# EAGLE design gt-jtx-m32-ver1.0 (EAGLE 8.1.0)
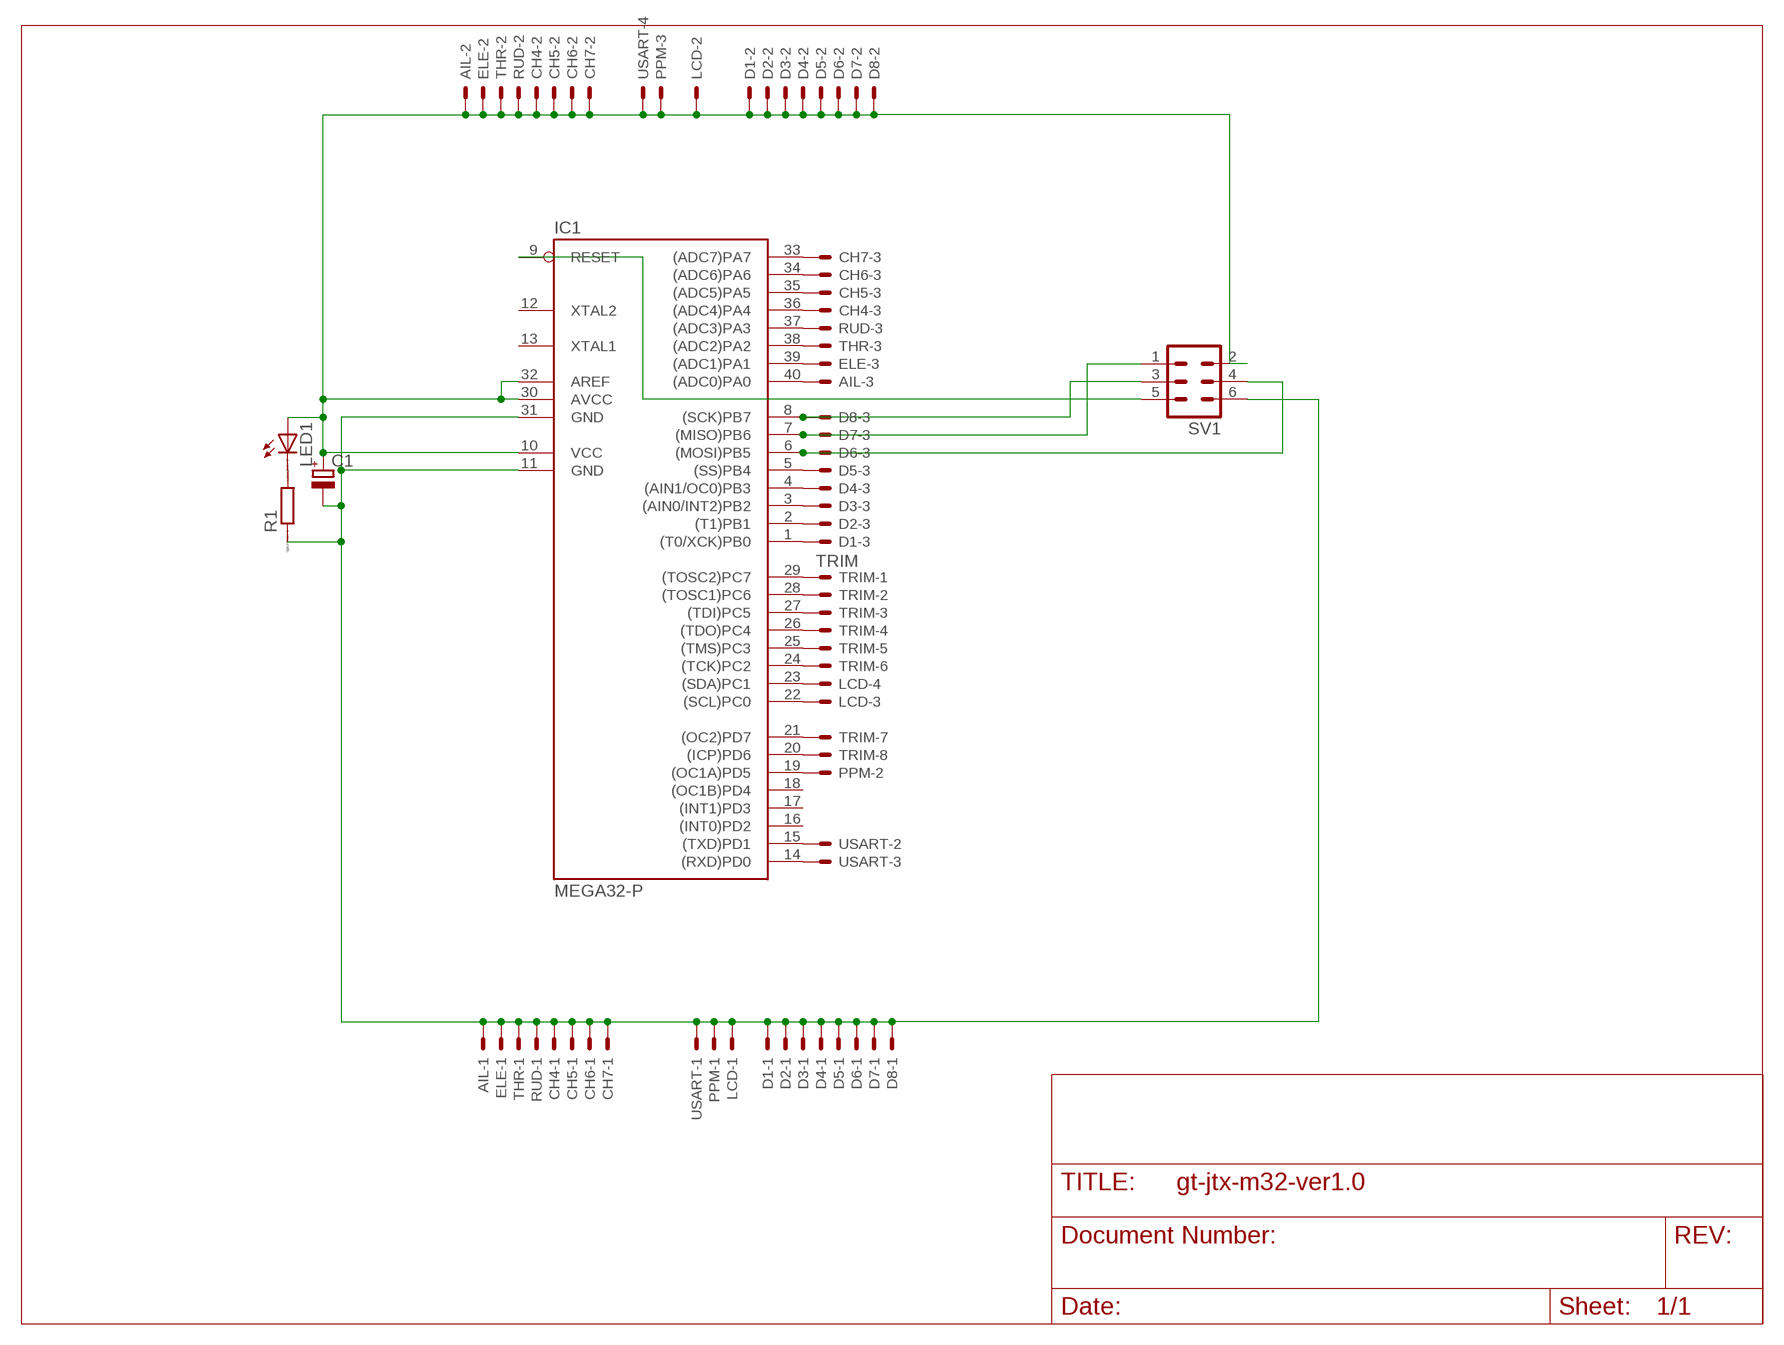
[diagram p0: schematic, sheet 1]

## Parts
AIL  JST-XH-03-PIN-LONG-PAD  [JST-XH-03-PACKAGE-LONG-PAD]
C1  CPOL-EUC  [PANASONIC_C]
CH4  JST-XH-03-PIN-LONG-PAD  [JST-XH-03-PACKAGE-LONG-PAD]
CH5  JST-XH-03-PIN-LONG-PAD  [JST-XH-03-PACKAGE-LONG-PAD]
CH6  JST-XH-03-PIN-LONG-PAD  [JST-XH-03-PACKAGE-LONG-PAD]
CH7  JST-XH-03-PIN-LONG-PAD  [JST-XH-03-PACKAGE-LONG-PAD]
D1  JST-XH-03-PIN-LONG-PAD  [JST-XH-03-PACKAGE-LONG-PAD]
D2  JST-XH-03-PIN-LONG-PAD  [JST-XH-03-PACKAGE-LONG-PAD]
D3  JST-XH-03-PIN-LONG-PAD  [JST-XH-03-PACKAGE-LONG-PAD]
D4  JST-XH-03-PIN-LONG-PAD  [JST-XH-03-PACKAGE-LONG-PAD]
D5  JST-XH-03-PIN-LONG-PAD  [JST-XH-03-PACKAGE-LONG-PAD]
D6  JST-XH-03-PIN-LONG-PAD  [JST-XH-03-PACKAGE-LONG-PAD]
D7  JST-XH-03-PIN-LONG-PAD  [JST-XH-03-PACKAGE-LONG-PAD]
D8  JST-XH-03-PIN-LONG-PAD  [JST-XH-03-PACKAGE-LONG-PAD]
ELE  JST-XH-03-PIN-LONG-PAD  [JST-XH-03-PACKAGE-LONG-PAD]
IC1  MEGA32-P  [DIL40]
LCD  JST-XH-04-PIN-LONG-PAD  [JST-XH-04-PACKAGE-LONG-PAD]
LED1  LED5MM  [LED5MM]
PPM  JST-XH-03-PIN-LONG-PAD  [JST-XH-03-PACKAGE-LONG-PAD]
R1  R0204/7  [0204/7]
RUD  JST-XH-03-PIN-LONG-PAD  [JST-XH-03-PACKAGE-LONG-PAD]
SV1  MA03-2  [MA03-2]
THR  JST-XH-03-PIN-LONG-PAD  [JST-XH-03-PACKAGE-LONG-PAD]
TRIM  TRIM  JST-XH-08-PIN-LONG-PAD  [JST-XH-08-PACKAGE-LONG-PAD]
USART  JST-XH-04-PIN-LONG-PAD  [JST-XH-04-PACKAGE-LONG-PAD]

## Nets
GND: AIL.1 C1.- CH4.1 CH5.1 CH6.1 CH7.1 D1.1 D2.1 D3.1 D4.1 D5.1 D6.1 D7.1 D8.1 ELE.1 IC1.11(GND) IC1.31(GND) LCD.1 PPM.1 R1.1 RUD.1 SV1.6 THR.1 USART.1
N$1: CH5.3 IC1.35((ADC5)PA5)
N$2: CH6.3 IC1.34((ADC6)PA6)
N$3: IC1.29((TOSC2)PC7) TRIM.1
N$4: IC1.28((TOSC1)PC6) TRIM.2
N$5: D1.3 IC1.1((T0/XCK)PB0)
N$6: IC1.15((TXD)PD1) USART.2
N$7: IC1.27((TDI)PC5) TRIM.3
N$8: IC1.26((TDO)PC4) TRIM.4
N$9: IC1.9(RESET) SV1.5
N$10: IC1.25((TMS)PC3) TRIM.5
N$11: IC1.24((TCK)PC2) TRIM.6
N$12: D6.3 IC1.6((MOSI)PB5) SV1.4
N$13: D7.3 IC1.7((MISO)PB6) SV1.1
N$14: D8.3 IC1.8((SCK)PB7) SV1.3
N$15: D2.3 IC1.2((T1)PB1)
N$16: IC1.21((OC2)PD7) TRIM.7
N$17: IC1.20((ICP)PD6) TRIM.8
N$18: IC1.14((RXD)PD0) USART.3
N$19: IC1.23((SDA)PC1) LCD.4
N$20: CH7.3 IC1.33((ADC7)PA7)
N$21: CH4.3 IC1.36((ADC4)PA4)
N$22: IC1.22((SCL)PC0) LCD.3
N$23: IC1.19((OC1A)PD5) PPM.2
N$24: D3.3 IC1.3((AIN0/INT2)PB2)
N$25: D4.3 IC1.4((AIN1/OC0)PB3)
N$26: D5.3 IC1.5((SS)PB4)
N$27: IC1.37((ADC3)PA3) RUD.3
N$28: IC1.38((ADC2)PA2) THR.3
N$29: ELE.3 IC1.39((ADC1)PA1)
N$30: AIL.3 IC1.40((ADC0)PA0)
N$32: LED1.K(C) R1.2
VCC: AIL.2 C1.+ CH4.2 CH5.2 CH6.2 CH7.2 D1.2 D2.2 D3.2 D4.2 D5.2 D6.2 D7.2 D8.2 ELE.2 IC1.10(VCC) IC1.30(AVCC) IC1.32(AREF) LCD.2 LED1.A PPM.3 RUD.2 SV1.2 THR.2 USART.4
Unconnected: IC1.12(XTAL2) IC1.13(XTAL1) IC1.16((INT0)PD2) IC1.17((INT1)PD3) IC1.18((OC1B)PD4)

## Library data of the parts
AIL CH4-CH7 D1-D8 ELE PPM RUD THR = Rembrandt Electronics - JST XH Connectors v1-0:JST-XH-03-PIN: JST XH Connector 2 Pin Wire to board connector. Pitch: 2,54 mm, (0.100") Number of pins: 3 Created by Rembrandt Electronics www.rembrandtelectronics.com
C1 = rcl:CPOL-EU: POLARIZED CAPACITOR, European symbol
IC1 = atmel:MEGA32-P: MICROCONTROLLER 32 Kbytes FLASH 2 Kbytes SRAM 1 Kbytes EEPROM USART 8-channel 10 bit ADC Source: www.atmel.com .. doc2503.pdf; MPN: ATMEGA32-16PU; OC_FARNELL: 1661729; OC_NEWARK: 51P1794
LCD USART = Rembrandt Electronics - JST XH Connectors v1-0:JST-XH-04-PIN: JST XH Connector 2 Pin Wire to board connector. Pitch: 2,54 mm, (0.100") Number of pins: 4 Created by Rembrandt Electronics www.rembrandtelectronics.com
LED1 = led:LED: LED OSRAM: - CHIPLED LG R971, LG N971, LY N971, LG Q971, LY Q971, LO R971, LY R971 LH N974, LH R974 LS Q976, LO Q976, LY Q976 LO Q996 - Hyper CHIPLED LW Q18S LB Q993, LB Q99A, LB R99A - SideLED LS A670, LO A670, LY A670, LG A670, LP A670 LB A673, LV A673, LT A673, LW A673 LH A674 LY A675 LS A676, LA A676, LO A676, LY A676, LW A676 LS A679, LY A679, LG A679 - Hyper Micro SIDELED® LS Y876, LA Y876, LO Y876, LY Y876 LT Y87S - SmartLED LW L88C, LW L88S LB L89C, LB L89S, LG L890 LS L89K, LO L89K, LY L89K LS L896, LA L896, LO L896, LY L896 - TOPLED LS T670, LO T670, LY T670, LG T670, LP T670 LSG T670, LSP T670, LSY T670, LOP T670, LYG T670 LG T671, LOG T671, LSG T671 LB T673, LV T673, LT T673, LW T673 LH T674 LS T676, LA T676, LO T676, LY T676, LB T676, LH T676, LSB T676, LW T676 LB T67C, LV T67C, LT T67C, LS T67K, LO T67K, LY T67K, LW E67C LS E67B, LA E67B, LO E67B, LY E67B, LB E67C, LV E67C, LT E67C LW T67C LS T679, LY T679, LG T679 LS T770, LO T770, LY T770, LG T770, LP T770 LB T773, LV T773, LT T773, LW T773 LH T774 LS E675, LA E675, LY E675, LS T675 LS T776, LA T776, LO T776, LY T776, LB T776 LHGB T686 LT T68C, LB T68C - Hyper Mini TOPLED® LB M676 - Mini TOPLED Santana® LG M470 LS M47K, LO M47K, LY M47K Source: http://www.osram.convergy.de LUXEON: - LUMILED® LXK2-PW12-R00, LXK2-PW12-S00, LXK2-PW14-U00, LXK2-PW14-V00 LXK2-PM12-R00, LXK2-PM12-S00, LXK2-PM14-U00 LXK2-PE12-Q00, LXK2-PE12-R00, LXK2-PE12-S00, LXK2-PE14-T00, LXK2-PE14-U00 LXK2-PB12-K00, LXK2-PB12-L00, LXK2-PB12-M00, LXK2-PB14-N00, LXK2-PB14-P00, LXK2-PB14-Q00 LXK2-PR12-L00, LXK2-PR12-M00, LXK2-PR14-Q00, LXK2-PR14-R00 LXK2-PD12-Q00, LXK2-PD12-R00, LXK2-PD12-S00 LXK2-PH12-R00, LXK2-PH12-S00 LXK2-PL12-P00, LXK2-PL12-Q00, LXK2-PL12-R00 Source: www.luxeon.com KINGBRIGHT: KA-3528ASYC Source: www.kingbright.com
R1 = eagle-ltspice:R: RESISTOR, European symbol; SPICEMODEL: NONE; SPICEPREFIX: R
SV1 = con-lstb:MA03-2: PIN HEADER; OC_FARNELL: unknown; OC_NEWARK: unknown
TRIM = Rembrandt Electronics - JST XH Connectors v1-0:JST-XH-08-PIN: JST XH Connector 2 Pin Wire to board connector. Pitch: 2,54 mm, (0.100") Number of pins: 8 Created by Rembrandt Electronics www.rembrandtelectronics.com

## Board
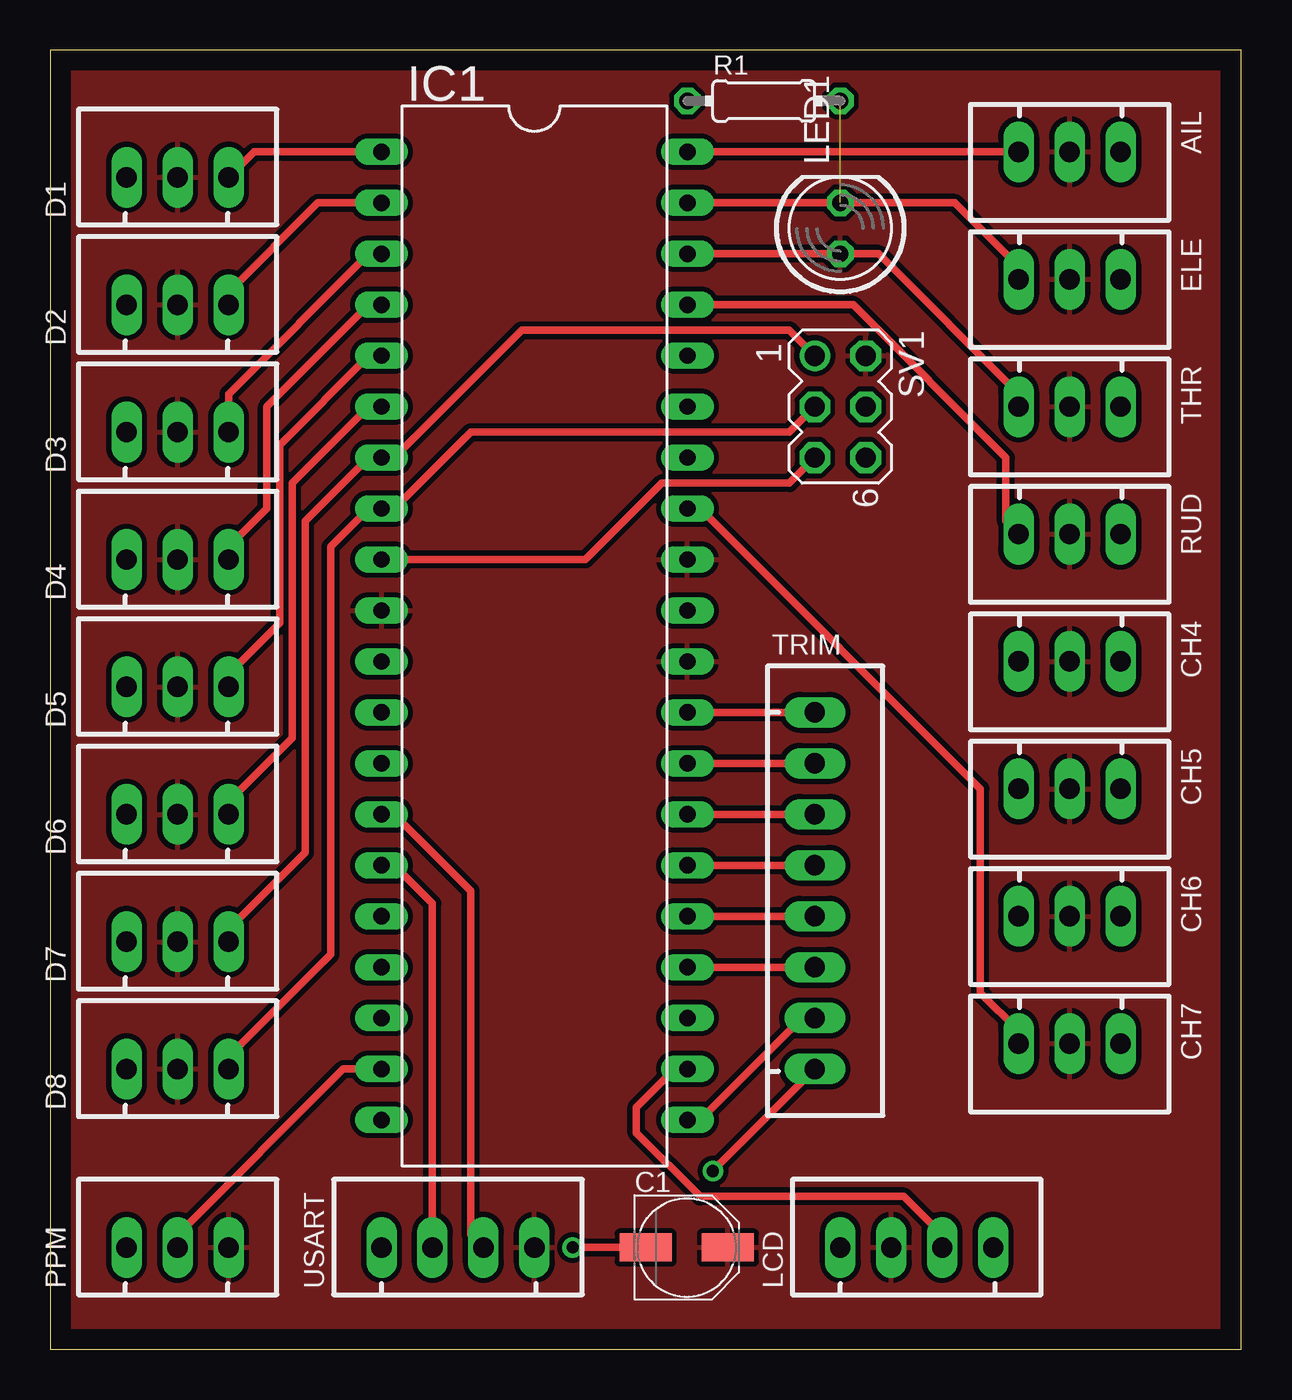
[diagram p1: board, top side]
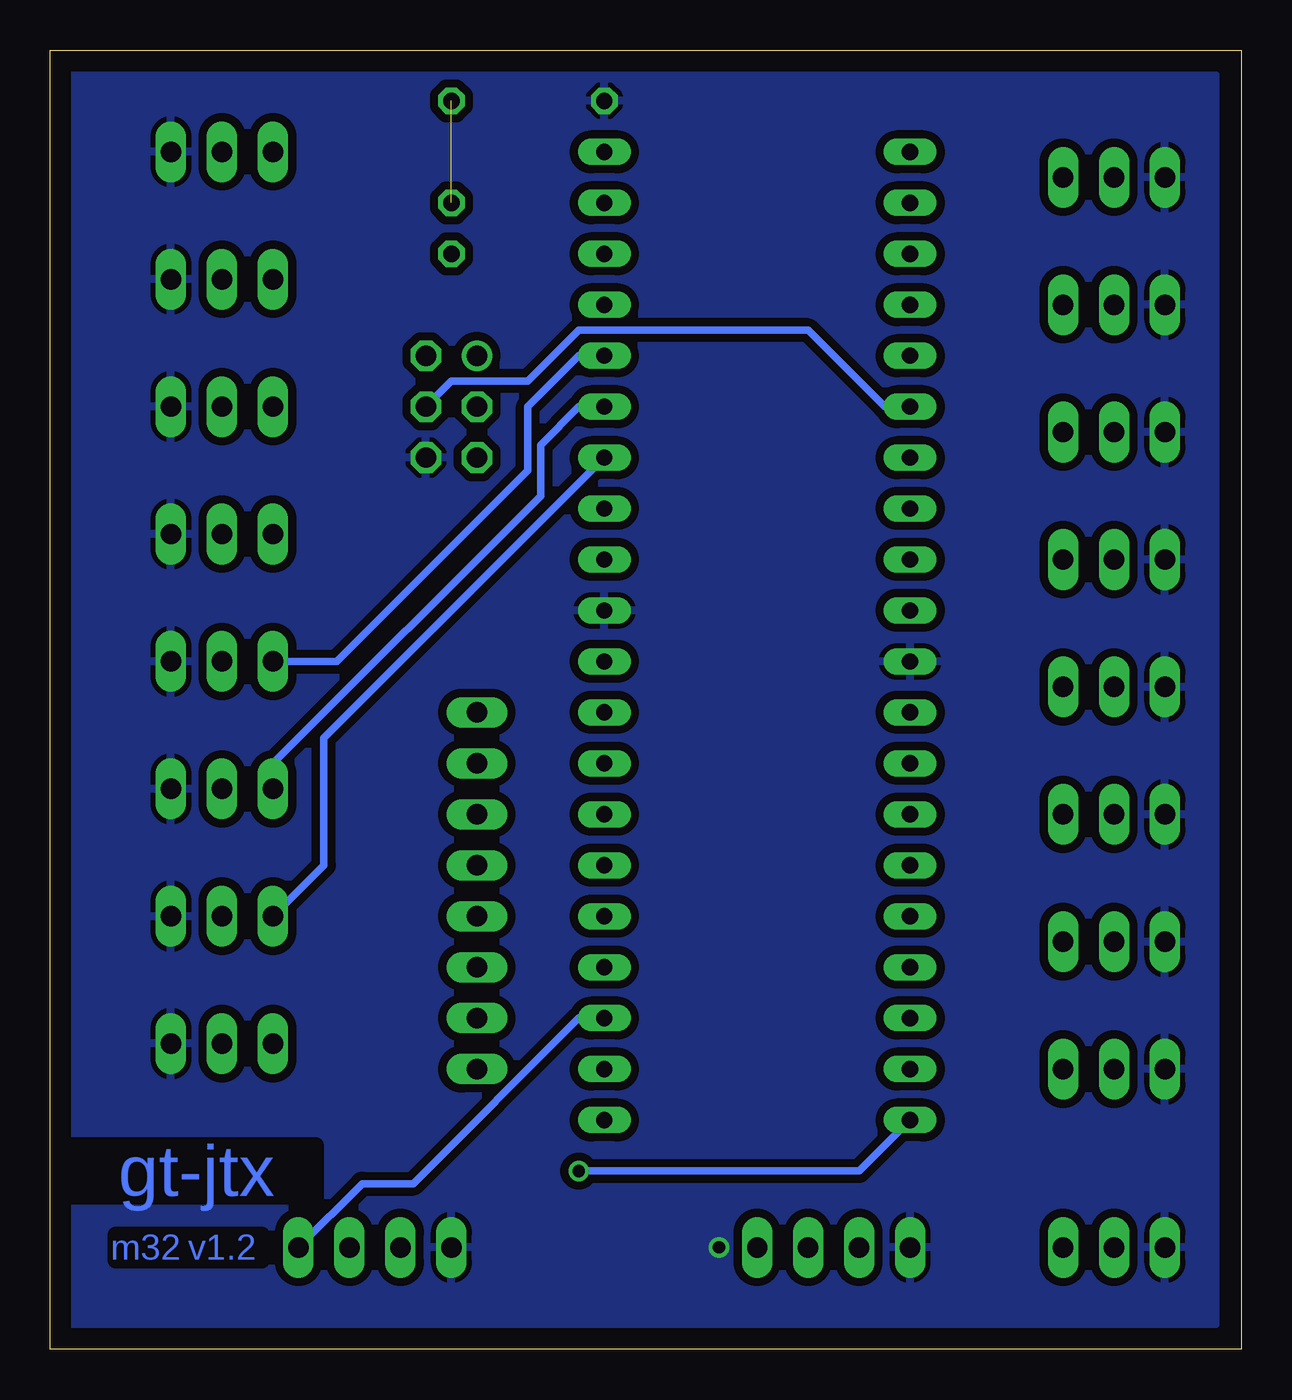
[diagram p2: board, bottom side, seen from below]

Size 59.36 x 64.76 mm. Coordinates in mm from the lower left corner, seen from the top.
Outline: 0,0 59.36,0 59.36,64.76 0,64.76 0,0
Copper layers (1*16): Top 0.035mm / dielectric 1.5mm / Bottom 0.035mm
Design rules "default *": minimum track width 15mil, minimum drill 24mil, track to track 10mil, track to pad 10mil, pad to pad 10mil, via to via 10mil, smd to smd 8mil, copper to edge 40mil, drill to drill 8mil, minimum pad ring 10mil, minimum via ring 8mil, stop-mask expansion 4mil, vias tented up to drill 0mil, thermal gap 10mil

### Footprints (pad centres in the part's own frame; a part is rotated, then mirrored left to right if it is on the bottom)
JST-XH-03-PACKAGE-LONG-PAD = drill 1.016 long: 1 -2.54,0; 2 0,0; 3 2.54,0
PANASONIC_C = smd 2.6 x 1.4: + 2.05,0; - -2.05,0
DIL40 = drill 0.813 long: 1 -24.13,-7.62; 2 -21.59,-7.62; 3 -19.05,-7.62; 4 -16.51,-7.62; 5 -13.97,-7.62; 6 -11.43,-7.62; 7 -8.89,-7.62; 8 -6.35,-7.62; 9 -3.81,-7.62; 10 -1.27,-7.62; 11 1.27,-7.62; 12 3.81,-7.62; 13 6.35,-7.62; 14 8.89,-7.62; 15 11.43,-7.62; 16 13.97,-7.62; 17 16.51,-7.62; 18 19.05,-7.62; 19 21.59,-7.62; 20 24.13,-7.62; 21 24.13,7.62; 22 21.59,7.62; 23 19.05,7.62; 24 16.51,7.62; 25 13.97,7.62; 26 11.43,7.62; 27 8.89,7.62; 28 6.35,7.62; 29 3.81,7.62; 30 1.27,7.62; 31 -1.27,7.62; 32 -3.81,7.62; 33 -6.35,7.62; 34 -8.89,7.62; 35 -11.43,7.62; 36 -13.97,7.62; 37 -16.51,7.62; 38 -19.05,7.62; 39 -21.59,7.62; 40 -24.13,7.62
JST-XH-04-PACKAGE-LONG-PAD = drill 1.016 long: 1 -3.81,0; 2 -1.27,0; 3 1.27,0; 4 3.81,0
LED5MM = drill 0.813 octagon: A -1.27,0; K 1.27,0
0204/7 = drill 0.813 octagon: 1 -3.81,0; 2 3.81,0
MA03-2 = drill 1.016: 1 -2.54,-1.27 | drill 1.016 octagon: 2 -2.54,1.27; 3 0,-1.27; 4 0,1.27; 5 2.54,-1.27; 6 2.54,1.27
JST-XH-08-PACKAGE-LONG-PAD = drill 1.016 long: 1 -8.89,0; 2 -6.35,0; 3 -3.81,0; 4 -1.27,0; 5 1.27,0; 6 3.81,0; 7 6.35,0; 8 8.89,0

### Placement (x,y rotation side)
AIL  50.8,59.69 180 top
C1  31.72,5.08 0 top
CH4  50.8,34.29 180 top
CH5  50.8,27.94 180 top
CH6  50.8,21.59 180 top
CH7  50.8,15.24 180 top
D1  6.35,58.42 0 top
D2  6.35,52.07 0 top
D3  6.35,45.72 0 top
D4  6.35,39.37 0 top
D5  6.35,33.02 0 top
D6  6.35,26.67 0 top
D7  6.35,20.32 0 top
D8  6.35,13.97 0 top
ELE  50.8,53.34 180 top
IC1  24.13,35.56 270 top
LCD  43.18,5.08 0 top
LED1  39.37,55.88 90 top
PPM  6.35,5.08 0 top
R1  35.56,62.23 0 top
RUD  50.8,40.64 180 top
SV1  39.37,46.99 270 top
THR  50.8,46.99 180 top
TRIM  38.1,22.86 270 top
USART  20.32,5.08 0 top

### Tracks (layer width: path | path; a pad name or v marks a point on that pad's centre or on a via)
GND  (via drill 0.61)
  Top 0.381: v26.04,5.08 C1.-
  pour Bottom (isolate 0.406): 1.27,63.5 58.42,63.5 58.42,1.27 1.27,1.27
N$1
  Bottom 0.381: IC1.35 33.02,46.99 34.92,45.09 34.92,42.55 48.26,29.21 CH5.3
N$2
  Bottom 0.381: IC1.34 45.72,30.48 45.72,24.13 CH6.3
N$3
  Top 0.381: TRIM.1 IC1.29
N$4
  Top 0.381: TRIM.2 IC1.28
N$5
  Top 0.381: IC1.1 10.16,59.69 D1.3
N$6
  Top 0.381: IC1.15 17.14,24.13 19.05,22.23 USART.2
N$7
  Top 0.381: TRIM.3 IC1.27
N$8
  Top 0.381: TRIM.4 IC1.26
N$9
  Top 0.381: IC1.9 26.67,39.37 30.48,43.18 36.83,43.18 SV1.5
N$10
  Top 0.381: TRIM.5 IC1.25
N$11
  Top 0.381: TRIM.6 IC1.24
N$12
  Top 0.381: IC1.6 15.88,46.99 12.06,43.18 12.06,30.48 8.89,27.3 D6.3
  Bottom 0.381: SV1.4 39.37,48.26 35.56,48.26 33.02,50.8 21.59,50.8 17.78,46.99 IC1.6
N$13
  Top 0.381: D7.3 8.89,20.95 12.7,24.77 12.7,41.27 15.88,44.45 IC1.7 17.14,44.45 23.5,50.8 36.83,50.8 SV1.1
N$14
  Top 0.381: D8.3 8.89,14.61 13.97,19.68 13.97,40.01 15.88,41.91 IC1.8 17.14,41.91 20.95,45.72 36.83,45.72 SV1.3
N$15
  Top 0.381: IC1.2 13.34,57.15 8.89,52.7 D2.3
N$16
  Top 0.381: IC1.21 32.38,11.43 37.47,16.51 TRIM.7
N$17  (via drill 0.61)
  Top 0.381: TRIM.8 v33.02,8.89
  Bottom 0.381: IC1.20 19.05,8.89 v33.02,8.89
N$18
  Top 0.381: IC1.14 17.14,26.67 20.95,22.86 20.95,5.71 USART.3
N$19
  Bottom 0.381: IC1.23 33.02,16.51 41.27,8.26 43.81,8.26 LCD.4
N$20
  Top 0.381: IC1.33 32.38,41.91 46.35,27.94 46.35,17.78 48.26,15.88 CH7.3
N$21
  Bottom 0.381: IC1.36 33.02,49.53 35.56,46.99 35.56,43.81 45.09,34.29 CH4.3
N$22
  Top 0.381: IC1.22 31.11,13.97 29.21,12.06 29.21,10.79 32.38,7.62 42.55,7.62 44.45,5.71 LCD.3
N$23
  Top 0.381: IC1.19 14.61,13.97 6.35,5.71 PPM.2
N$24
  Top 0.381: IC1.3 15.88,54.61 8.89,47.62 D3.3
N$25
  Top 0.381: IC1.4 15.88,52.07 10.79,46.99 10.79,41.91 8.89,40.01 D4.3
N$26
  Top 0.381: IC1.5 15.88,49.53 11.43,45.09 11.43,36.2 8.89,33.66 D5.3
N$27
  Top 0.381: IC1.37 40.01,52.07 47.62,44.45 47.62,41.27 RUD.3
N$28
  Top 0.381: IC1.38 41.27,54.61 48.26,47.62 THR.3
N$29
  Top 0.381: IC1.39 45.09,57.15 48.26,53.98 ELE.3
N$30
  Top 0.381: AIL.3 IC1.40
N$32  (1 unrouted)
VCC
  pour Top: 0,64.77 59.69,64.77 59.69,0 0,0

### Text on the board
Bottom: gt-jtx | v1.2 | m32